# EAGLE schematic HARRY2 (EAGLE 8.5.0)
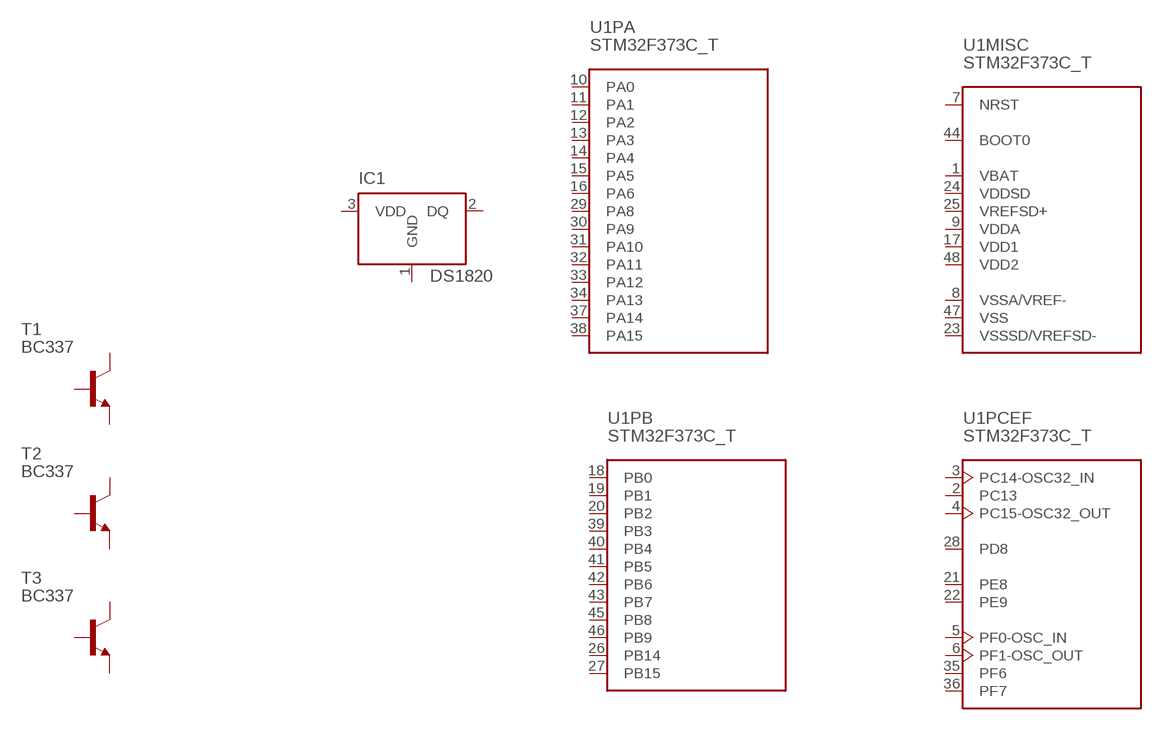
[diagram p0: schematic, sheet 1]

## Parts
IC1  DS1820  [TO-92]
T1  BC337  [TO92]
T2  BC337  [TO92]
T3  BC337  [TO92]
U1  STM32F373C_T  [LQFP48-7X7]
Unconnected: IC1.2(DQ) IC1.3(VDD) T1.1(E) T1.2(B) T1.3(C) T2.1(E) T2.2(B) T2.3(C) T3.1(E) T3.2(B) T3.3(C) U1.2(PCEF:PC13) U1.3(PCEF:PC14-OSC32_IN) U1.4(PCEF:PC15-OSC32_OUT) U1.5(PCEF:PF0-OSC_IN) U1.6(PCEF:PF1-OSC_OUT) U1.7(MISC:NRST) U1.10(PA:PA0) U1.11(PA:PA1) U1.12(PA:PA2) U1.13(PA:PA3) U1.14(PA:PA4) U1.15(PA:PA5) U1.16(PA:PA6) U1.18(PB:PB0) U1.19(PB:PB1) U1.20(PB:PB2) U1.21(PCEF:PE8) U1.22(PCEF:PE9) U1.26(PB:PB14) U1.27(PB:PB15) U1.28(PCEF:PD8) U1.29(PA:PA8) U1.30(PA:PA9) U1.31(PA:PA10) U1.32(PA:PA11) U1.33(PA:PA12) U1.34(PA:PA13) U1.35(PCEF:PF6) U1.36(PCEF:PF7) U1.37(PA:PA14) U1.38(PA:PA15) U1.39(PB:PB3) U1.40(PB:PB4) U1.41(PB:PB5) U1.42(PB:PB6) U1.43(PB:PB7) U1.44(MISC:BOOT0) U1.45(PB:PB8) U1.46(PB:PB9)

## Power pins joined to a net without a drawn wire
GND: IC1.1(GND)
VBAT: U1.1(MISC:VBAT)
VDD1: U1.17(MISC:VDD1)
VDD2: U1.48(MISC:VDD2)
VDDA: U1.9(MISC:VDDA)
VDDSD: U1.24(MISC:VDDSD)
VREFSD+: U1.25(MISC:VREFSD+)
VSS: U1.47(MISC:VSS)
VSSA/VREF-: U1.8(MISC:VSSA/VREF-)
VSSSD/VREFSD-: U1.23(MISC:VSSSD/VREFSD-)

## Library data of the parts
IC1 = DS1820:DS1820: DS1820 - 1-Wire Digital Thermometer
T1-T3 = transistor-neu-to92:BC337: NPN TRANSISTOR
U1 = STM32F373:STM32F373C_: STM32F373Cxx 48 pin ARM®Cortex®-M4 32b MCU+FPU,up to 256KB Flash+32KB SRAM timers, 4 ADCs (12/16-bit),3DACs,2comp.,2.0-3.6V operation